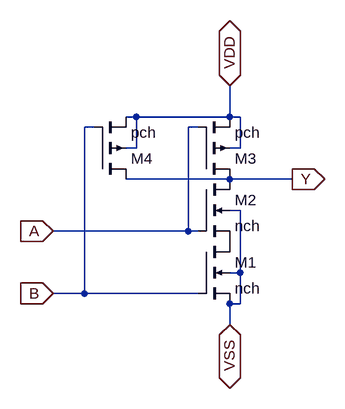
[diagram p0: schematic nand2.asc]
nand2.asc, the LTspice schematic file:
Version 4
SHEET 1 880 680
WIRE 32 16 16 16
WIRE 176 16 176 -32
WIRE 176 16 32 16
WIRE 192 16 176 16
WIRE -32 32 -48 32
WIRE 128 32 112 32
WIRE 32 64 32 16
WIRE 32 64 16 64
WIRE 192 64 192 16
WIRE 192 64 176 64
WIRE 176 112 16 112
WIRE 272 112 176 112
WIRE 192 160 176 160
WIRE 112 192 112 32
WIRE 112 192 -96 192
WIRE 128 192 112 192
WIRE 192 256 192 160
WIRE 192 256 176 256
WIRE -48 288 -48 32
WIRE -48 288 -96 288
WIRE 128 288 -48 288
WIRE 192 304 192 256
WIRE 192 304 176 304
WIRE 176 336 176 304
FLAG 272 112 Y
IOPIN 272 112 Out
FLAG -96 192 A
IOPIN -96 192 In
FLAG -96 288 B
IOPIN -96 288 In
FLAG 176 336 VSS
IOPIN 176 336 BiDir
FLAG 176 -32 VDD
IOPIN 176 -32 BiDir
SYMBOL nmos4 128 208 R0
SYMATTR InstName M1
SYMATTR Value nch
SYMATTR Value2 l=ln w=wn
SYMBOL nmos4 128 112 R0
SYMATTR InstName M2
SYMATTR Value nch
SYMATTR Value2 l=ln w=wn
SYMBOL pmos4 128 112 M180
SYMATTR InstName M3
SYMATTR Value pch
SYMATTR Value2 l=lp w=wp
SYMBOL pmos4 -32 112 M180
SYMATTR InstName M4
SYMATTR Value pch
SYMATTR Value2 l=lp w=wp

The netlist it stands for:
* nand2.asc
M1 P001 B VSS VSS nch l=ln w=wn
M2 Y A P001 VSS nch l=ln w=wn
M3 Y A VDD VDD pch l=lp w=wp
M4 Y B VDD VDD pch l=lp w=wp
.model NMOS NMOS
.model PMOS PMOS
.lib standard.mos
.backanno
.end